# EAGLE design G851X (EAGLE 6.6.0)
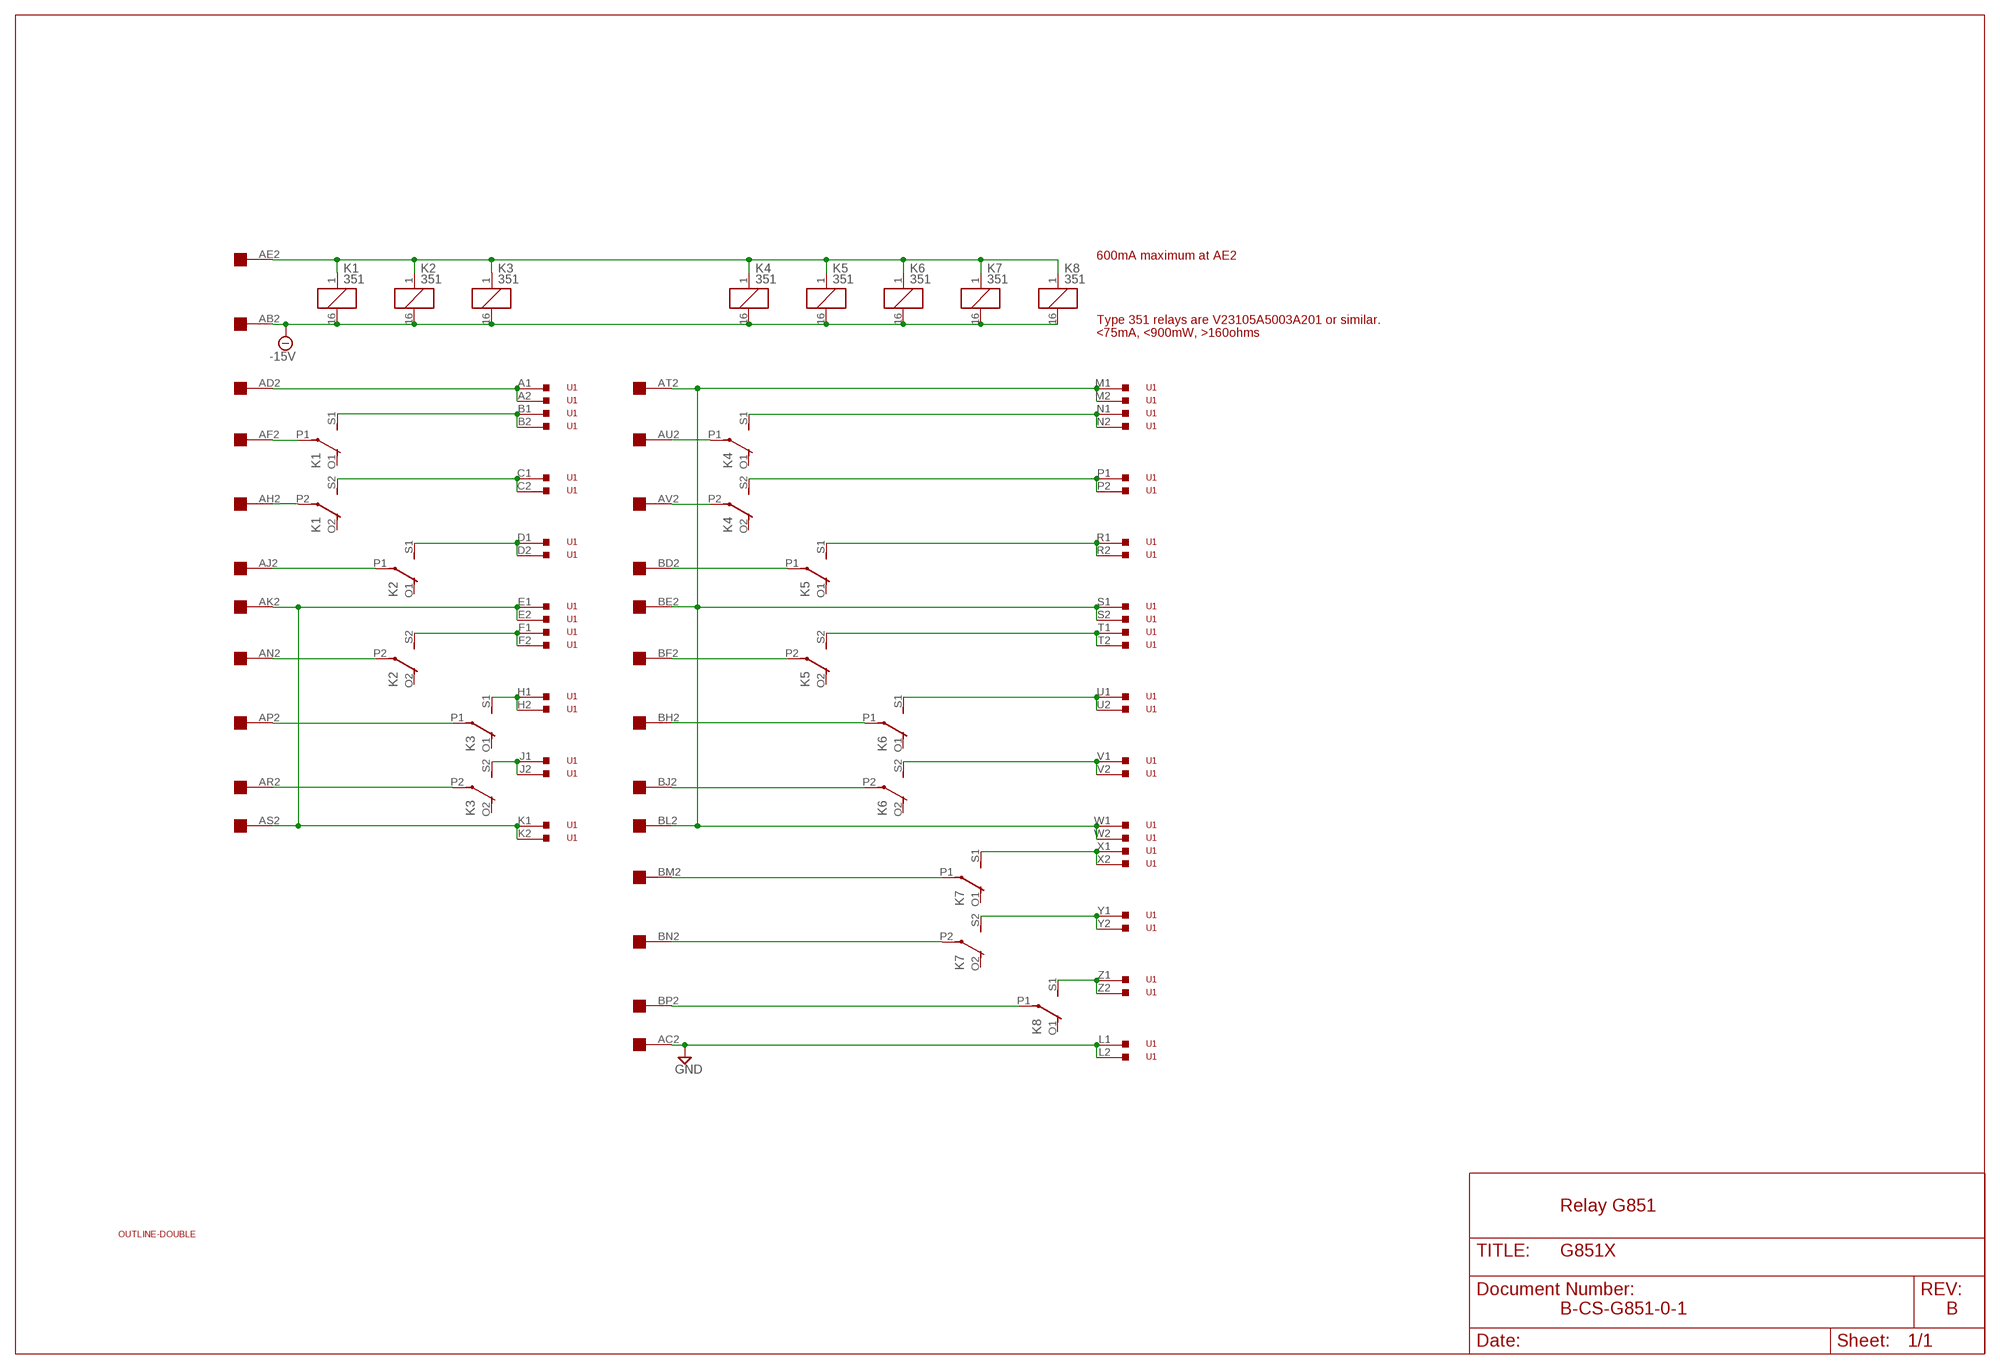
[diagram p0: schematic, sheet 1]

## Parts
K1  351  [351]
K2  351  [351]
K3  351  [351]
K4  351  [351]
K5  351  [351]
K6  351  [351]
K7  351  [351]
K8  351  [351]
U1  S7346-ND  133-022-03  [133-022-03]
U$1  DOUBLE  [EDGE-CON4]
U$3  OUTLINE-DOUBLE  [DOUBLE]

## Nets
-15V [Supply]: K1.16 K2.16 K3.16 K4.16 K5.16 K6.16 K7.16 K8.16 U$1.AB2
GND [Supply]: U1.L1 U1.L2 U$1.AC2
N$1 [Supply]: U1.A1 U1.A2 U$1.AD2
N$2 [Supply]: K1.P1(2:P) U$1.AF2
N$3 [Supply]: K1.P2(3:P) U$1.AH2
N$4 [Supply]: K2.P1(2:P) U$1.AJ2
N$5 [Supply]: K2.P2(3:P) U$1.AN2
N$6 [Supply]: K3.P1(2:P) U$1.AP2
N$7 [Supply]: K3.P2(3:P) U$1.AR2
N$8 [Supply]: U1.E1 U1.E2 U1.K1 U1.K2 U$1.AK2 U$1.AS2
N$9 [Supply]: U1.M1 U1.M2 U1.S1 U1.S2 U1.W1 U1.W2 U$1.AT2 U$1.BE2 U$1.BL2
N$10 [Supply]: K7.P1(2:P) U$1.BM2
N$11 [Supply]: K7.P2(3:P) U$1.BN2
N$12 [Supply]: K8.P1(2:P) U$1.BP2
N$13 [Supply]: K6.P2(3:P) U$1.BJ2
N$14 [Supply]: K6.P1(2:P) U$1.BH2
N$15 [Supply]: K5.P2(3:P) U$1.BF2
N$16 [Supply]: K5.P1(2:P) U$1.BD2
N$17 [Supply]: K4.P2(3:P) U$1.AV2
N$18 [Supply]: K4.P1(2:P) U$1.AU2
N$19 [Supply]: K1.1 K2.1 K3.1 K4.1 K5.1 K6.1 K7.1 K8.1 U$1.AE2
N$20 [Supply]: K2.S1(2:S) U1.D1 U1.D2
N$21 [Supply]: K1.S2(3:S) U1.C1 U1.C2
N$22 [Supply]: K1.S1(2:S) U1.B1 U1.B2
N$23 [Supply]: K7.S2(3:S) U1.Y1 U1.Y2
N$24 [Supply]: K2.S2(3:S) U1.F1 U1.F2
N$25 [Supply]: K3.S1(2:S) U1.H1 U1.H2
N$26 [Supply]: K3.S2(3:S) U1.J1 U1.J2
N$27 [Supply]: K4.S1(2:S) U1.N1 U1.N2
N$28 [Supply]: K4.S2(3:S) U1.P1 U1.P2
N$29 [Supply]: K5.S1(2:S) U1.R1 U1.R2
N$30 [Supply]: K5.S2(3:S) U1.T1 U1.T2
N$31 [Supply]: K6.S1(2:S) U1.U1 U1.U2
N$32 [Supply]: K6.S2(3:S) U1.V1 U1.V2
N$33 [Supply]: K7.S1(2:S) U1.X1 U1.X2
N$34 [Supply]: K8.S1(2:S) U1.Z1 U1.Z2
Unconnected: K1.O1(2:O) K1.O2(3:O) K2.O1(2:O) K2.O2(3:O) K3.O1(2:O) K3.O2(3:O) K4.O1(2:O) K4.O2(3:O) K5.O1(2:O) K5.O2(3:O) K6.O1(2:O) K6.O2(3:O) K7.O1(2:O) K7.O2(3:O) K8.O1(2:O) K8.O2(3:O) K8.P2(3:P) K8.S2(3:S) U$1.AA1 U$1.AA2 U$1.AB1 U$1.AC1 U$1.AD1 U$1.AE1 U$1.AF1 U$1.AH1 U$1.AJ1 U$1.AK1 U$1.AL1 U$1.AL2 U$1.AM1 U$1.AM2 U$1.AN1 U$1.AP1 U$1.AR1 U$1.AS1 U$1.AT1 U$1.AU1 U$1.AV1 U$1.BA1 U$1.BA2 U$1.BB1 U$1.BB2 U$1.BC1 U$1.BC2 U$1.BD1 U$1.BE1 U$1.BF1 U$1.BH1 U$1.BJ1 U$1.BK1 U$1.BK2 U$1.BL1 U$1.BM1 U$1.BN1 U$1.BP1 U$1.BR1 U$1.BR2 U$1.BS1 U$1.BS2 U$1.BT1 U$1.BT2 U$1.BU1 U$1.BU2 U$1.BV1 U$1.BV2

## Notes on the sheet
- 600mA maximum at AE2
- Type 351 relays are V23105A5003A201 or similar.
- <75mA, <900mW, >160ohms
- Relay G851
- B-CS-G851-0-1 | B

## Library data of the parts
K1-K8 = relay:351: RELAY 2 x switch, Omron; OC_FARNELL: unknown; OC_NEWARK: unknown
U1 = dec-con:133-022-03: Pseudo-edge connector, 22 pins .156" spacing.
U$1 = dec-con:DOUBLE: Double-Height DEC board
U$3 = dec-con:OUTLINE-*: Board outlines for DEC boards.

## Net classes
1 Supply: width 0.813 mm

## Board
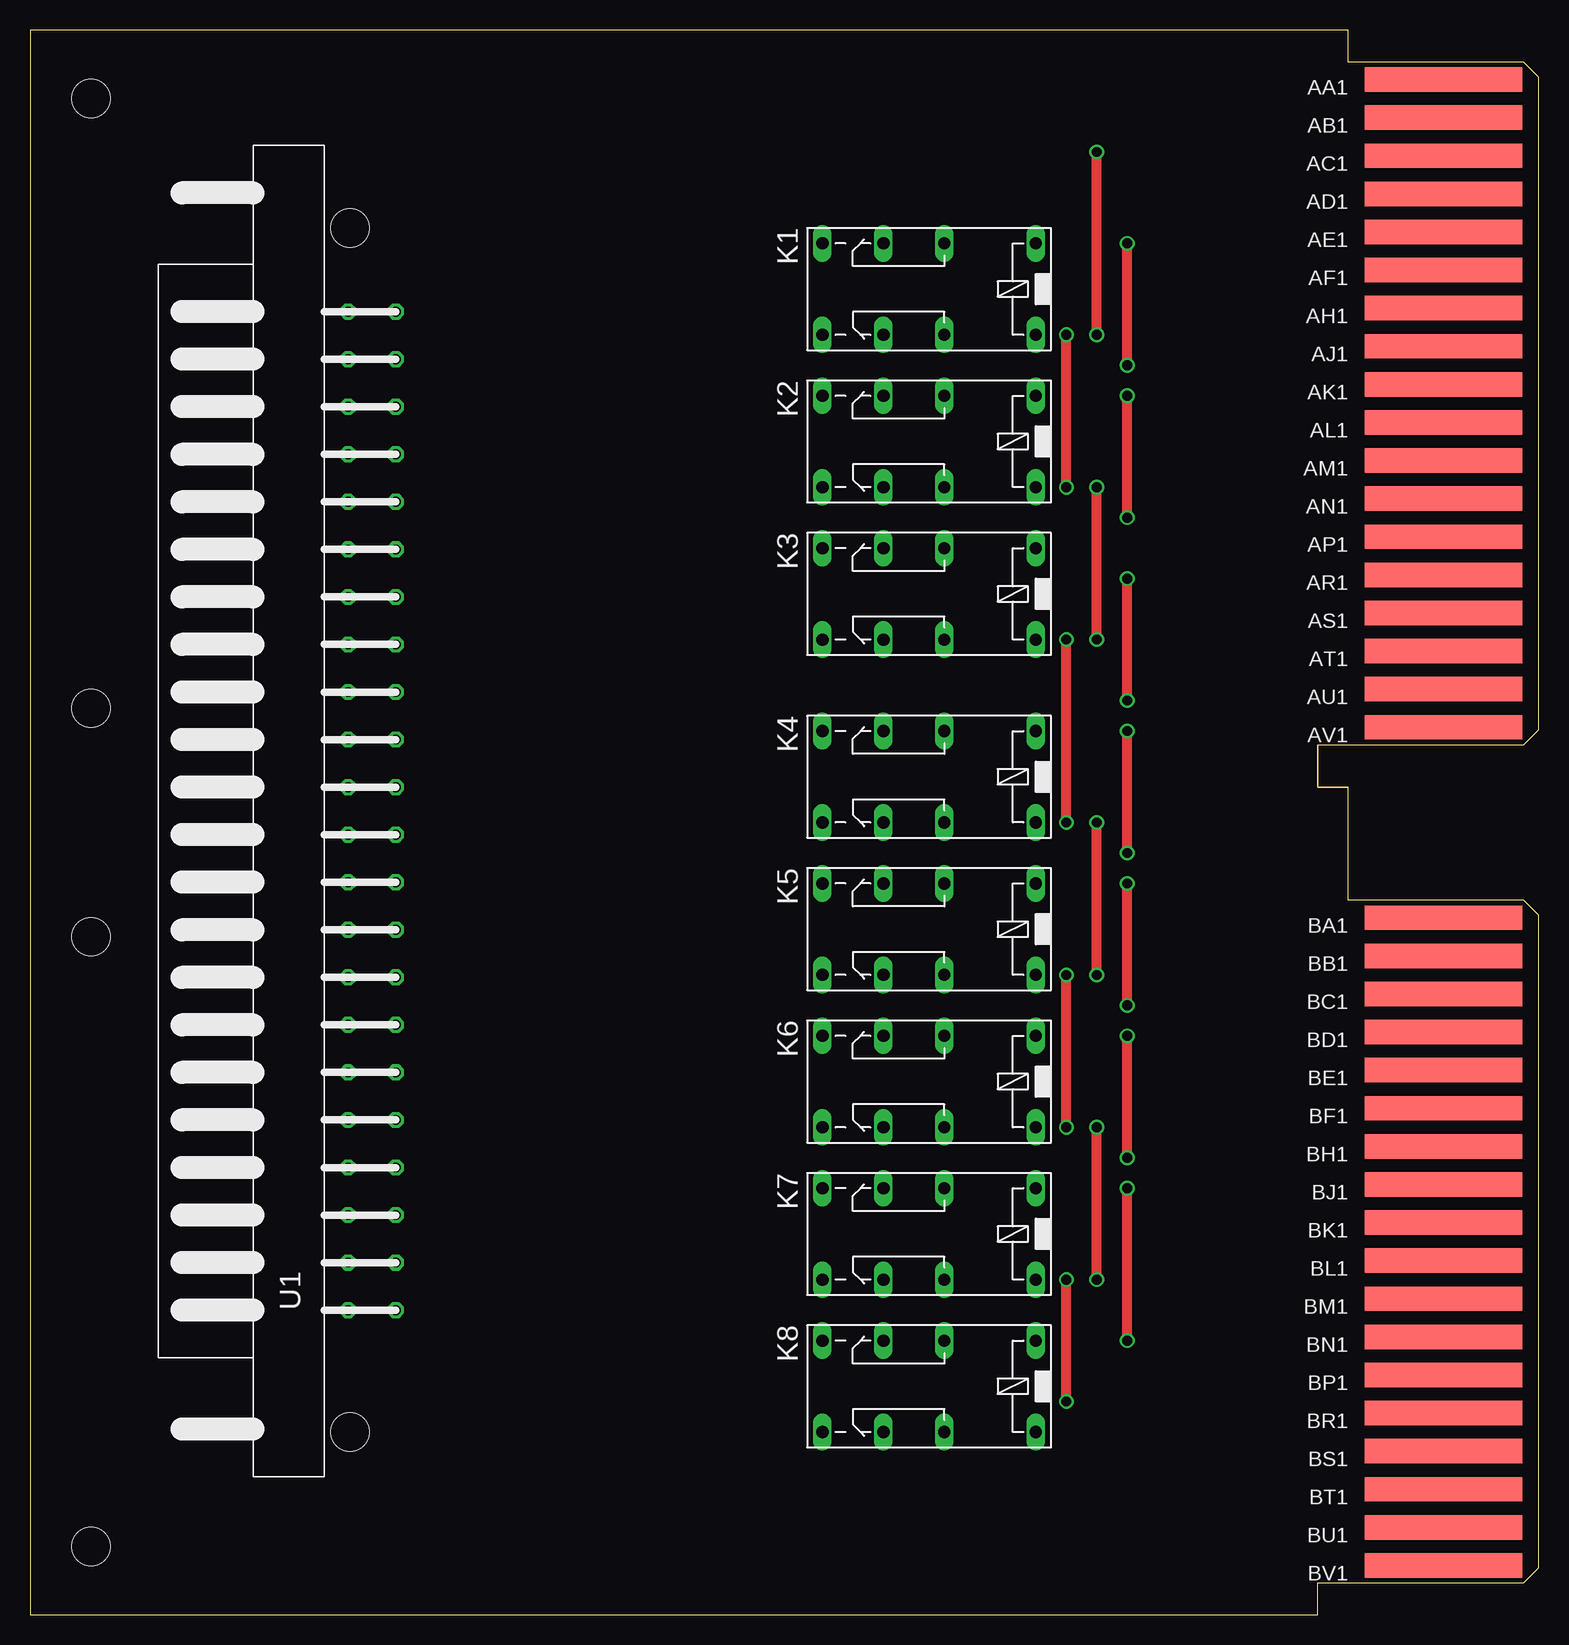
[diagram p1: board, top side]
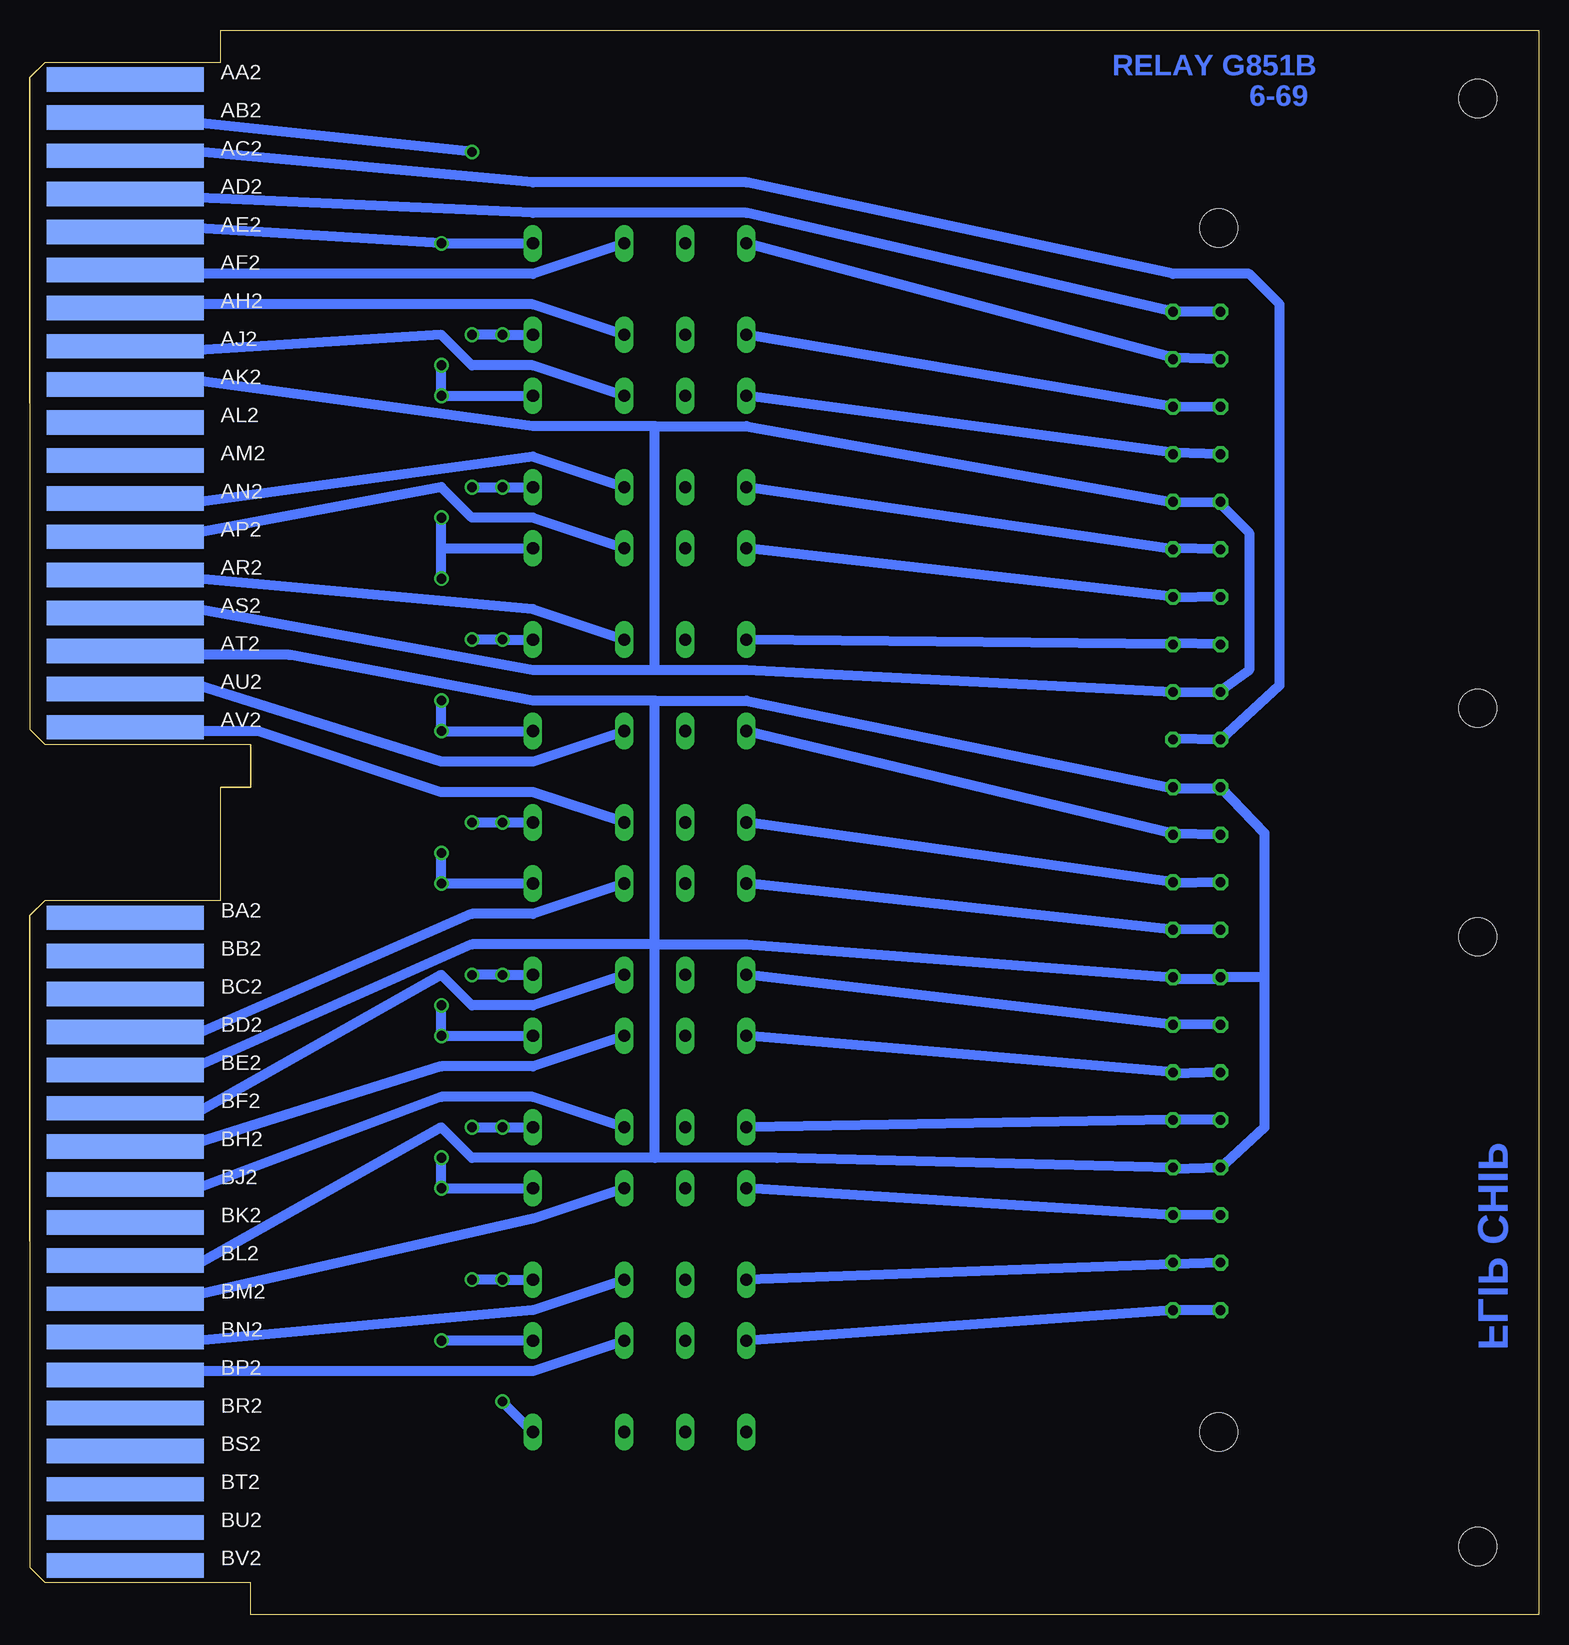
[diagram p2: board, bottom side, seen from below]

Size 125.73 x 132.08 mm. Coordinates in mm from the lower left corner, seen from the top.
Copper layers (1+16): Top 0.035mm / dielectric 1.5mm / Bottom 0.035mm
Design rules "16mils": minimum track width 16mil, minimum drill 32mil, track to track 15mil, track to pad 10mil, pad to pad 10mil, via to via 10mil, smd to smd 10mil, copper to edge 13mil, drill to drill 10mil, minimum pad ring 10mil, minimum via ring 8mil, stop-mask expansion 0mil, vias tented up to drill 0mil, thermal gap 10mil
Holes 3.17 mm at 26.67,15.24 26.67,115.57

### Footprints (pad centres in the part's own frame; a part is rotated, then mirrored left to right if it is on the bottom)
351 = drill 1.016 long: 1 -3.81,-3.81; 16 -3.81,3.81; O1 8.89,-3.81; O2 8.89,3.81; P1 3.81,-3.81; P2 3.81,3.81; S1 13.97,-3.81; S2 13.97,3.81
133-022-03 = drill 0.813 octagon: A1 83.21,0; A2 83.21,3.962; B1 79.248,0; B2 79.248,3.962; C1 75.286,0; C2 75.286,3.962; D1 71.323,0; D2 71.323,3.962; E1 67.361,0; E2 67.361,3.962; F1 63.398,0; F2 63.398,3.962; H1 59.436,0; H2 59.436,3.962; J1 55.474,0; J2 55.474,3.962; K1 51.511,0; K2 51.511,3.962; L1 47.549,0; L2 47.549,3.962; M1 43.586,0; M2 43.586,3.962; N1 39.624,0; N2 39.624,3.962; P1 35.662,0; P2 35.662,3.962; R1 31.699,0; R2 31.699,3.962; S1 27.737,0; S2 27.737,3.962; T1 23.774,0; T2 23.774,3.962; U1 19.812,0; U2 19.812,3.962; V1 15.85,0; V2 15.85,3.962; W1 11.887,0; W2 11.887,3.962; X1 7.925,0; X2 7.925,3.962; Y1 3.962,0; Y2 3.962,3.962; Z1 0,0; Z2 0,3.962
EDGE-CON4 = smd 13.106 x 2.032: AA1 7.938,4.128; AB1 7.938,7.303; AC1 7.938,10.477; AD1 7.938,13.652; AE1 7.938,16.828; AF1 7.938,20.003; AH1 7.938,23.177; AJ1 7.938,26.352; AK1 7.938,29.527; AL1 7.938,32.703; AM1 7.938,35.877; AN1 7.938,39.053; AP1 7.938,42.227; AR1 7.938,45.403; AS1 7.938,48.578; AT1 7.938,51.752; AU1 7.938,54.928; AV1 7.938,58.102; BA1 7.938,73.978; BB1 7.938,77.153; BC1 7.938,80.328; BD1 7.938,83.502; BE1 7.938,86.677; BF1 7.938,89.853; BH1 7.938,93.028; BJ1 7.938,96.203; BK1 7.938,99.377; BL1 7.938,102.552; BM1 7.938,105.728; BN1 7.938,108.903; BP1 7.938,112.078; BR1 7.938,115.252; BS1 7.938,118.427; BT1 7.938,121.603; BU1 7.938,124.778; BV1 7.938,127.953 | smd 13.106 x 2.032 bottom: AA2 7.938,4.128; AB2 7.938,7.303; AC2 7.938,10.477; AD2 7.938,13.652; AE2 7.938,16.828; AF2 7.938,20.003; AH2 7.938,23.177; AJ2 7.938,26.352; AK2 7.938,29.527; AL2 7.938,32.703; AM2 7.938,35.877; AN2 7.938,39.053; AP2 7.938,42.227; AR2 7.938,45.403; AS2 7.938,48.578; AT2 7.938,51.752; AU2 7.938,54.928; AV2 7.938,58.102; BA2 7.938,73.978; BB2 7.938,77.153; BC2 7.938,80.328; BD2 7.938,83.502; BE2 7.938,86.677; BF2 7.938,89.853; BH2 7.938,93.028; BJ2 7.938,96.203; BK2 7.938,99.377; BL2 7.938,102.552; BM2 7.938,105.728; BN2 7.938,108.903; BP2 7.938,112.078; BR2 7.938,115.252; BS2 7.938,118.427; BT2 7.938,121.603; BU2 7.938,124.778; BV2 7.938,127.953
DOUBLE = hole 3.175: 120.65,56.515; 120.65,5.715; 120.65,75.565; 120.65,126.365

### Placement (x,y rotation side)
K1  80.01,110.49 180 top
K2  80.01,97.79 180 top
K3  80.01,85.09 180 top
K4  80.01,69.85 180 top
K5  80.01,57.15 180 top
K6  80.01,44.45 180 top
K7  80.01,31.75 180 top
K8  80.01,19.05 180 top
U1  30.48,25.4 90 top
U$1  125.73,132.08 180 top
U$3  125.73,132.08 180 top

### Tracks (layer width: path | path; a pad name or v marks a point on that pad's centre or on a via)
-15V  (via drill 0.81)
  Top 0.813: v88.9,106.68 v88.9,121.92 | v86.36,93.98 v86.36,106.68 | v88.9,81.28 v88.9,93.98 | v86.36,66.04 v86.36,81.28 | v88.9,53.34 v88.9,66.04 | v86.36,40.64 v86.36,53.34 | v88.9,27.94 v88.9,40.64 | v86.36,17.78 v86.36,27.94
  Bottom 0.813: U$1.AB2 117.13,124.75 113.03,124.46 v88.9,121.92 | K8.16 v86.36,17.78 | K1.16 v86.36,106.68 v88.9,106.68 | v88.9,93.98 v86.36,93.98 K2.16 | K3.16 v86.36,81.28 v88.9,81.28 | K4.16 v88.9,66.04 v86.36,66.04 | K5.16 v86.36,53.34 v88.9,53.34 | K7.16 v86.36,27.94 v88.9,27.94 | K6.16 v88.9,40.64 v86.36,40.64
GND
  Bottom 0.813: U1.L1 30.48,73.03 U1.L2 21.59,77.47 21.59,109.22 24.13,111.76 30.48,111.76 66.04,119.38 83.82,119.38 111.76,121.92 116.84,121.92 U$1.AC2
N$1
  Bottom 0.813: U1.A2 30.48,108.58 U1.A1 66.04,116.84 83.82,116.84 111.76,118.11 116.84,118.11 U$1.AD2
N$2
  Bottom 0.813: U$1.AF2 116.84,111.76 83.82,111.76 K1.P1
N$3
  Bottom 0.813: U$1.AH2 111.76,109.22 83.82,109.22 K1.P2
N$4
  Bottom 0.813: U$1.AJ2 115.57,105.41 111.76,105.41 91.44,106.68 88.9,104.14 83.82,104.14 K2.P1
N$5
  Bottom 0.813: U$1.AN2 116.84,92.71 111.76,92.71 83.82,96.52 K2.P2
N$6
  Bottom 0.813: U$1.AP2 116.84,90.17 111.76,90.17 91.44,93.98 88.9,91.44 83.82,91.44 K3.P1
N$7
  Bottom 0.813: U$1.AR2 116.84,86.36 111.76,86.36 83.82,83.82 K3.P2
N$8
  Bottom 0.813: 30.48,92.71 U1.E1 | 30.48,92.71 U1.E2 26.67,92.71 24.13,90.17 24.13,78.74 26.35,77.15 | U1.K2 30.48,76.83 U1.K1 66.04,78.74 73.66,78.74 | U$1.AS2 116.84,83.82 111.76,83.82 83.82,78.74 73.66,78.74 | U$1.AK2 116.84,102.87 111.76,102.87 83.82,99.06 73.66,99.06 | 30.48,92.71 66.04,99.06 73.66,99.06 | 73.66,78.74 73.66,99.06
N$9
  Bottom 0.813: 30.48,68.9 U1.M1 | 30.48,68.9 26.99,68.9 | 26.99,68.9 26.67,68.9 | 26.35,53.02 30.48,53.02 U1.S1 66.04,55.88 73.66,55.88 | U1.S2 22.86,53.14 22.86,53.34 | U1.W2 30.48,37.15 U1.W1 63.5,38.1 73.66,38.1 | U$1.BL2 116.84,29.21 111.76,29.21 91.44,40.64 88.9,38.1 73.66,38.1 | 73.66,38.1 73.66,55.88 | 73.66,55.88 88.9,55.88 111.76,45.72 116.84,45.72 U$1.BE2 | U$1.AT2 116.84,80.01 104.14,80.01 83.82,76.2 73.66,76.2 | 30.48,68.9 66.04,76.2 73.66,76.2 | 73.66,55.88 73.66,76.2 | 22.86,53.34 22.86,65.18 U1.M2 26.99,68.9 | 22.86,53.34 22.86,40.64 26.67,37.15
N$10
  Bottom 0.813: U$1.BM2 116.84,26.67 111.76,26.67 83.82,33.02 K7.P1
N$11
  Bottom 0.813: U$1.BN2 116.84,22.86 111.76,22.86 83.82,25.4 K7.P2
N$12
  Bottom 0.813: U$1.BP2 116.84,20.32 83.82,20.32 K8.P1
N$13
  Bottom 0.813: U$1.BJ2 111.76,35.56 91.44,43.18 83.82,43.18 K6.P2
N$14
  Bottom 0.813: U$1.BH2 111.76,39.37 91.44,45.72 83.82,45.72 K6.P1
N$15
  Bottom 0.813: U$1.BF2 111.76,41.91 91.44,53.34 88.9,50.8 83.82,50.8 K5.P2
N$16
  Bottom 0.813: U$1.BD2 111.45,48.56 88.9,58.42 83.82,58.42 K5.P1
N$17
  Bottom 0.813: U$1.AV2 116.84,73.66 106.68,73.66 91.44,68.58 83.82,68.58 K4.P2
N$18
  Bottom 0.813: U$1.AU2 116.84,77.47 111.76,77.47 91.44,71.12 83.82,71.12 K4.P1
N$19  (via drill 0.81)
  Top 0.813: v91.44,104.14 v91.44,114.3 | v91.44,91.44 v91.44,101.6 | v91.44,76.2 v91.44,86.36 | v91.44,63.5 v91.44,73.66 | v91.44,50.8 v91.44,60.96 | v91.44,38.1 v91.44,48.26 | v91.44,22.86 v91.44,35.56
  Bottom 0.813: U$1.AE2 117.17,115.24 116.84,115.57 111.76,115.57 v91.44,114.3 K1.1 | K2.1 v91.44,101.6 v91.44,104.14 | K4.1 v91.44,73.66 v91.44,76.2 | 91.44,88.9 K3.1 | 91.44,88.9 v91.44,91.44 | v91.44,86.36 91.44,88.9 | K8.1 v91.44,22.86 | K7.1 v91.44,35.56 v91.44,38.1 | K6.1 v91.44,48.26 v91.44,50.8 | K5.1 v91.44,60.96 v91.44,63.5
N$20
  Bottom 0.813: 30.48,96.84 U1.D1 | U1.D2 30.48,96.84 | 30.48,96.84 K2.S1
N$21
  Bottom 0.813: U1.C2 30.16,100.65 U1.C1 K1.S2
N$22
  Bottom 0.813: 30.48,104.78 U1.B1 | U1.B2 30.48,104.78 | 30.48,104.78 K1.S1
N$23
  Bottom 0.813: 30.48,29.21 U1.Y1 | U1.Y2 30.48,29.21 | 30.48,29.21 K7.S2
N$24
  Bottom 0.813: U1.F2 30.48,88.9 U1.F1 K2.S2
N$25
  Bottom 0.813: U1.H2 30.48,84.77 U1.H1 K3.S1
N$26
  Bottom 0.813: U1.J2 30.48,80.96 U1.J1 K3.S2
N$27
  Bottom 0.813: 30.48,65.09 U1.N1 | U1.N2 30.48,65.09 | 30.48,65.09 K4.S1
N$28
  Bottom 0.813: U1.P2 30.48,60.96 U1.P1 K4.S2
N$29
  Bottom 0.813: U1.R2 30.16,57.15 U1.R1 K5.S1
N$30
  Bottom 0.813: U1.T2 30.48,49.21 U1.T1 K5.S2
N$31
  Bottom 0.813: U1.U2 30.48,45.09 U1.U1 K6.S1
N$32
  Bottom 0.813: U1.V2 30.48,41.27 U1.V1 K6.S2
N$33
  Bottom 0.813: U1.X2 30.48,33.34 U1.X1 K7.S1
N$34
  Bottom 0.813: U1.Z2 U1.Z1 K8.S1

### Text on the board
Bottom: RELAY G851B | 6-69 | FLIP CHIP